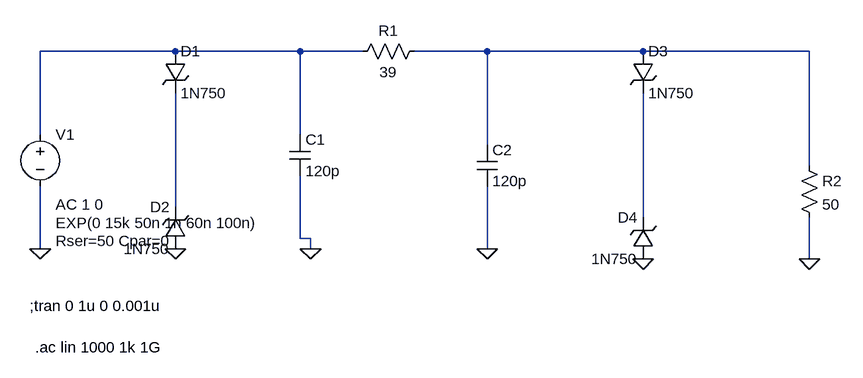
[diagram p0: schematic Zadatak03.asc]
Zadatak03.asc, the LTspice schematic file:
Version 4
SHEET 1 1272 680
WIRE 240 -32 32 -32
WIRE 432 -32 240 -32
WIRE 528 -32 432 -32
WIRE 720 -32 608 -32
WIRE 960 -32 720 -32
WIRE 1216 -32 960 -32
WIRE 32 96 32 -32
WIRE 432 96 432 -32
WIRE 720 112 720 -32
WIRE 1216 144 1216 -32
WIRE 240 208 240 32
WIRE 960 224 960 32
WIRE 432 256 432 160
WIRE 448 256 432 256
WIRE 32 272 32 176
WIRE 448 272 448 256
WIRE 720 272 720 176
WIRE 1216 288 1216 224
FLAG 240 272 0
FLAG 448 272 0
FLAG 720 272 0
FLAG 32 272 0
FLAG 960 288 0
FLAG 1216 288 0
SYMBOL voltage 32 80 R0
WINDOW 3 24 152 Left 2
WINDOW 123 24 124 Left 2
WINDOW 39 24 180 Left 2
SYMATTR Value EXP(0 15k 50n 1n 60n 100n)
SYMATTR Value2 AC 1 0
SYMATTR SpiceLine Rser=50 Cpar=0
SYMATTR InstName V1
SYMBOL cap 416 96 R0
SYMATTR InstName C1
SYMATTR Value 120p
SYMBOL res 512 -16 R270
WINDOW 0 32 56 VTop 2
WINDOW 3 0 56 VBottom 2
SYMATTR InstName R1
SYMATTR Value 39
SYMBOL cap 704 112 R0
SYMATTR InstName C2
SYMATTR Value 120p
SYMBOL res 1200 128 R0
SYMATTR InstName R2
SYMATTR Value 50
SYMBOL zener 224 -32 R0
SYMATTR InstName D1
SYMATTR Value 1N750
SYMBOL zener 256 272 R180
WINDOW 0 24 64 Left 2
WINDOW 3 24 0 Left 2
SYMATTR InstName D2
SYMATTR Value 1N750
SYMBOL zener 944 -32 R0
SYMATTR InstName D3
SYMATTR Value 1N750
SYMBOL zener 976 288 R180
WINDOW 0 24 64 Left 2
WINDOW 3 24 0 Left 2
SYMATTR InstName D4
SYMATTR Value 1N750
TEXT 16 360 Left 2 !;tran 0 1u 0 0.001u
TEXT 24 424 Left 2 !.ac lin 1000 1k 1G

The netlist it stands for:
* Zadatak03.asc
V1 N001 0 EXP(0 15k 50n 1n 60n 100n) AC 1 0 Rser=50 Cpar=0
C1 N001 0 120p
R1 N001 N002 39
C2 N002 0 120p
R2 N002 0 50
D1 N001 N003 1N750
D2 0 N003 1N750
D3 N002 N004 1N750
D4 0 N004 1N750
.model D D
.lib standard.dio
;tran 0 1u 0 0.001u
.ac lin 1000 1k 1G
.backanno
.end